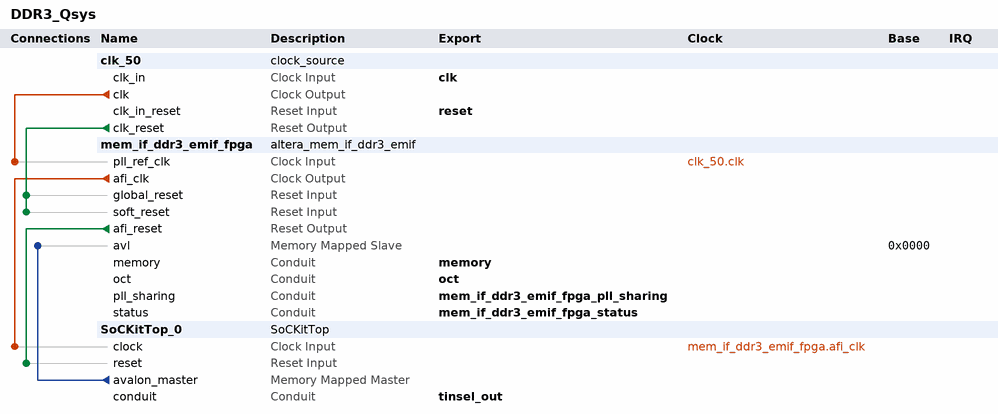
[diagram p0: system contents]
# Platform Designer (Qsys) system DDR3_Qsys, Cyclone V 5CSXFC6D6F31C8ES
# Parameters at their usual value, and those the tool derives, are not listed.
package require -exact qsys 16.0
create_system DDR3_Qsys
set_project_property DEVICE_FAMILY {Cyclone V}
set_project_property DEVICE 5CSXFC6D6F31C8ES

add_instance clk_50 clock_source 16.0
set_instance_parameter_value clk_50 clockFrequency 50000000

add_instance mem_if_ddr3_emif_fpga altera_mem_if_ddr3_emif 16.0
set_instance_parameter_value mem_if_ddr3_emif_fpga AVL_MAX_SIZE 4
set_instance_parameter_value mem_if_ddr3_emif_fpga CALIBRATION_MODE Full
set_instance_parameter_value mem_if_ddr3_emif_fpga CPORT_TYPE_PORT Bidirectional,Bidirectional,Bidirectional,Bidirectional,Bidirectional,Bidirectional
set_instance_parameter_value mem_if_ddr3_emif_fpga EXPORT_AFI_HALF_CLK false
set_instance_parameter_value mem_if_ddr3_emif_fpga HARD_EMIF false
set_instance_parameter_value mem_if_ddr3_emif_fpga MEM_BANKADDR_WIDTH 3
set_instance_parameter_value mem_if_ddr3_emif_fpga MEM_CLK_FREQ 300.0
set_instance_parameter_value mem_if_ddr3_emif_fpga MEM_CLK_FREQ_MAX 400.0
set_instance_parameter_value mem_if_ddr3_emif_fpga MEM_COL_ADDR_WIDTH 10
set_instance_parameter_value mem_if_ddr3_emif_fpga MEM_DQ_WIDTH 32
set_instance_parameter_value mem_if_ddr3_emif_fpga MEM_FORMAT DISCRETE
set_instance_parameter_value mem_if_ddr3_emif_fpga MEM_ROW_ADDR_WIDTH 15
set_instance_parameter_value mem_if_ddr3_emif_fpga MEM_TCL 6
set_instance_parameter_value mem_if_ddr3_emif_fpga MEM_TFAW_NS 50.0
set_instance_parameter_value mem_if_ddr3_emif_fpga MEM_TRAS_NS 37.5
set_instance_parameter_value mem_if_ddr3_emif_fpga MEM_TRCD_NS 15.0
set_instance_parameter_value mem_if_ddr3_emif_fpga MEM_TRFC_NS 300.0
set_instance_parameter_value mem_if_ddr3_emif_fpga MEM_TRP_NS 15.0
set_instance_parameter_value mem_if_ddr3_emif_fpga MEM_TRRD_NS 13.2
set_instance_parameter_value mem_if_ddr3_emif_fpga MEM_TRTP_NS 13.2
set_instance_parameter_value mem_if_ddr3_emif_fpga MEM_TWTR 4
set_instance_parameter_value mem_if_ddr3_emif_fpga MEM_VENDOR JEDEC
set_instance_parameter_value mem_if_ddr3_emif_fpga MEM_WTCL 5
set_instance_parameter_value mem_if_ddr3_emif_fpga PLL_LOCATION Top_Bottom
set_instance_parameter_value mem_if_ddr3_emif_fpga POWER_OF_TWO_BUS false
set_instance_parameter_value mem_if_ddr3_emif_fpga PRIORITY_PORT 1,1,1,1,1,1
set_instance_parameter_value mem_if_ddr3_emif_fpga RATE Half
set_instance_parameter_value mem_if_ddr3_emif_fpga REF_CLK_FREQ 50.0
set_instance_parameter_value mem_if_ddr3_emif_fpga SPEED_GRADE 8
set_instance_parameter_value mem_if_ddr3_emif_fpga TIMING_BOARD_AC_SKEW 0.03
set_instance_parameter_value mem_if_ddr3_emif_fpga TIMING_BOARD_AC_TO_CK_SKEW 0.0
set_instance_parameter_value mem_if_ddr3_emif_fpga TIMING_BOARD_DQ_TO_DQS_SKEW 0.0
set_instance_parameter_value mem_if_ddr3_emif_fpga TIMING_BOARD_MAX_CK_DELAY 0.03
set_instance_parameter_value mem_if_ddr3_emif_fpga TIMING_BOARD_MAX_DQS_DELAY 0.03
set_instance_parameter_value mem_if_ddr3_emif_fpga TIMING_BOARD_SKEW_BETWEEN_DQS 0.08
set_instance_parameter_value mem_if_ddr3_emif_fpga TIMING_BOARD_SKEW_CKDQS_DIMM_MAX 0.0
set_instance_parameter_value mem_if_ddr3_emif_fpga TIMING_BOARD_SKEW_CKDQS_DIMM_MIN 0.0
set_instance_parameter_value mem_if_ddr3_emif_fpga TIMING_BOARD_SKEW_WITHIN_DQS 0.01
set_instance_parameter_value mem_if_ddr3_emif_fpga TIMING_TDH 150
set_instance_parameter_value mem_if_ddr3_emif_fpga TIMING_TDQSCK 400
set_instance_parameter_value mem_if_ddr3_emif_fpga TIMING_TDQSQ 200
set_instance_parameter_value mem_if_ddr3_emif_fpga TIMING_TDQSS 0.25
set_instance_parameter_value mem_if_ddr3_emif_fpga TIMING_TDS 75
set_instance_parameter_value mem_if_ddr3_emif_fpga TIMING_TDSH 0.2
set_instance_parameter_value mem_if_ddr3_emif_fpga TIMING_TDSS 0.2
set_instance_parameter_value mem_if_ddr3_emif_fpga TIMING_TIH 275
set_instance_parameter_value mem_if_ddr3_emif_fpga TIMING_TIS 200
set_instance_parameter_value mem_if_ddr3_emif_fpga TIMING_TQSH 0.38
set_instance_parameter_value mem_if_ddr3_emif_fpga USER_DEBUG_LEVEL 1

add_instance SoCKitTop_0 SoCKitTop 1.0

# connections
add_connection clk_50.clk mem_if_ddr3_emif_fpga.pll_ref_clk clock
add_connection mem_if_ddr3_emif_fpga.afi_clk SoCKitTop_0.clock clock
add_connection clk_50.clk_reset mem_if_ddr3_emif_fpga.global_reset reset
add_connection clk_50.clk_reset mem_if_ddr3_emif_fpga.soft_reset reset
add_connection mem_if_ddr3_emif_fpga.afi_reset SoCKitTop_0.reset reset
add_connection SoCKitTop_0.avalon_master mem_if_ddr3_emif_fpga.avl avalon
set_connection_parameter_value SoCKitTop_0.avalon_master/mem_if_ddr3_emif_fpga.avl baseAddress 0x0000

# exported interfaces
add_interface clk clock sink
set_interface_property clk EXPORT_OF clk_50.clk_in
add_interface mem_if_ddr3_emif_fpga_pll_sharing conduit end
set_interface_property mem_if_ddr3_emif_fpga_pll_sharing EXPORT_OF mem_if_ddr3_emif_fpga.pll_sharing
add_interface mem_if_ddr3_emif_fpga_status conduit end
set_interface_property mem_if_ddr3_emif_fpga_status EXPORT_OF mem_if_ddr3_emif_fpga.status
add_interface memory conduit end
set_interface_property memory EXPORT_OF mem_if_ddr3_emif_fpga.memory
add_interface oct conduit end
set_interface_property oct EXPORT_OF mem_if_ddr3_emif_fpga.oct
add_interface reset reset sink
set_interface_property reset EXPORT_OF clk_50.clk_in_reset
add_interface tinsel_out conduit end
set_interface_property tinsel_out EXPORT_OF SoCKitTop_0.conduit

set_interconnect_requirement {$system} qsys_mm.clockCrossingAdapter FIFO
set_interconnect_requirement {$system} qsys_mm.maxAdditionalLatency 2

save_system DDR3_Qsys.qsys
